# Altium schematic sheet PCB.SchDoc
size A4; PageSetup: Record=PageOptions|CenterHorizontal=True|CenterVertical=True|PrintScale=1.00|XCorrection=1.00|YCorrection=1.00|PrintKind=0|BorderSize=5000000|LeftOffset=0|BottomOffset=0|Orientation=2|PaperLength=1000|PaperWidth=1000|Scale=100|PaperSource=7|PrintQuality=-3|MediaType=1|DitherType=10|PrintScaleMode=1|PaperKind=A4|PaperIndex=9
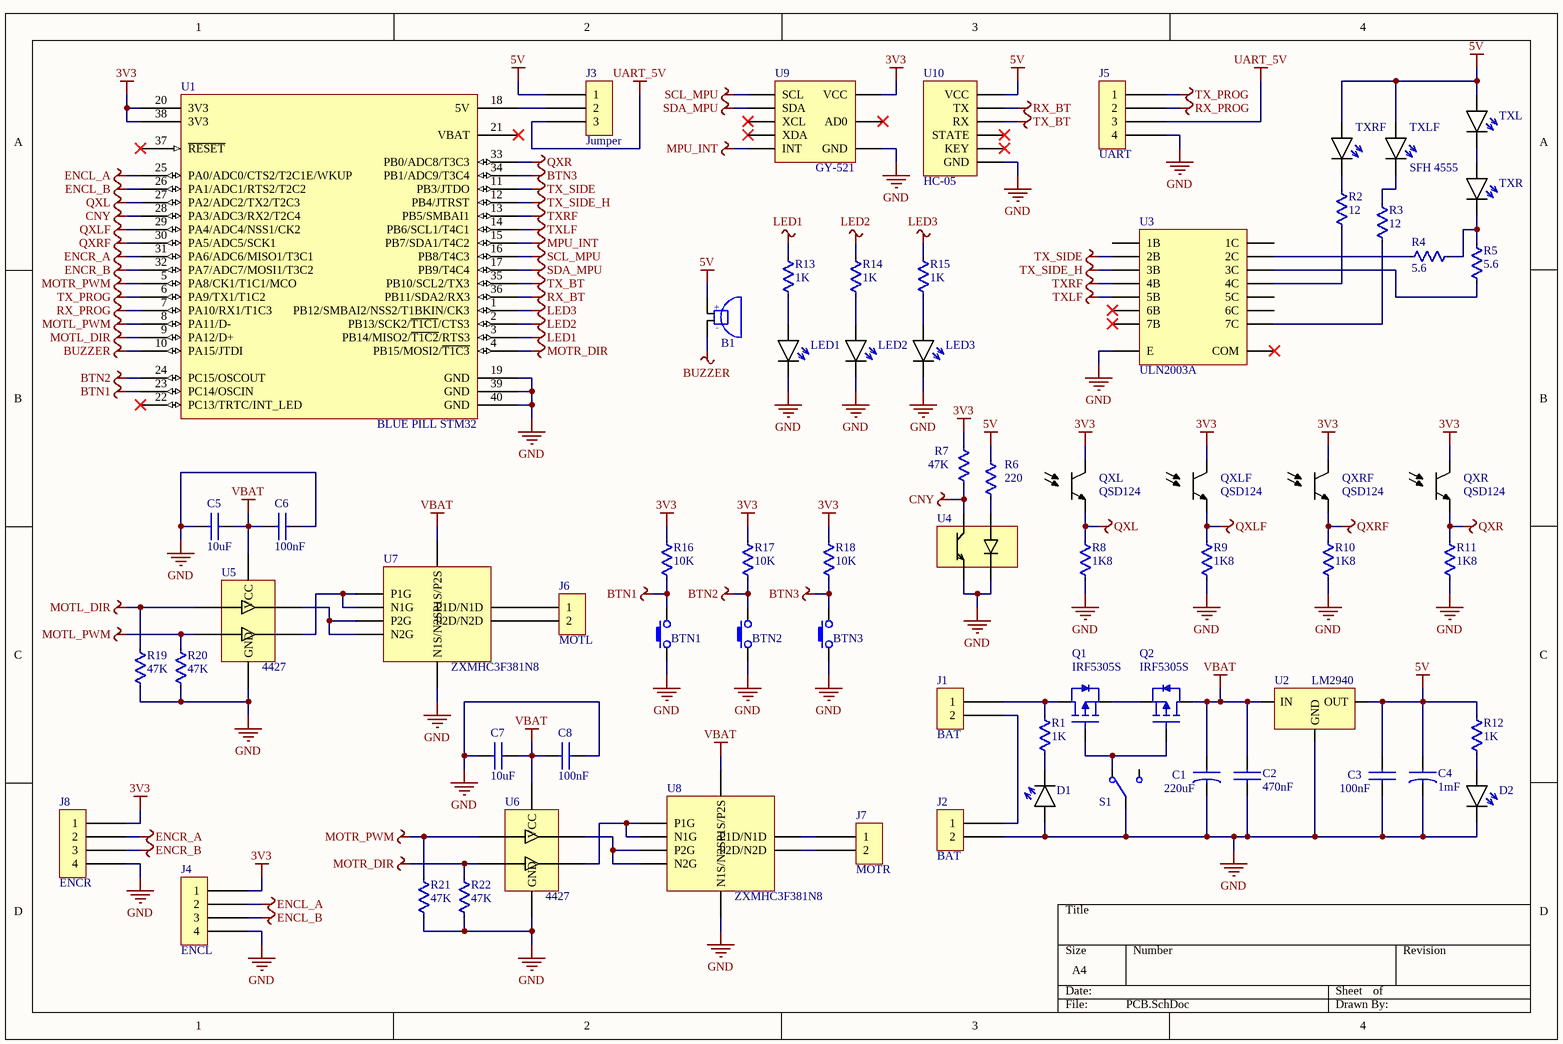
[diagram p0: PCB.SchDoc]

## Parts
B1  BUZZER  [BUZZER-12MM]  (value not drawn)
BTN1  BUTTON  [TACT_SWITCH-SMALL-4PIN]  (value not drawn)
BTN2  BUTTON  [TACT_SWITCH-SMALL-4PIN]  (value not drawn)
BTN3  BUTTON  [TACT_SWITCH-SMALL-4PIN]  (value not drawn)
C1  value 220uF  [CAP-ELEC-5x11x2mm]  (hidden comment: CAP-ELEC)
C2  value 470nF  [C1206]  (hidden comment: CAP-CER)
C3  value 100nF  [C1206]  (hidden comment: CAP-CER)
C4  value 1mF  [CAP-ELEC-5x11x2mm]  (hidden comment: CAP-ELEC)
C5  value 10uF  [C1206]  (hidden comment: CAP-CER)
C6  value 100nF  [C1206]  (hidden comment: CAP-CER)
C7  value 10uF  [C1206]  (hidden comment: CAP-CER)
C8  value 100nF  [C1206]  (hidden comment: CAP-CER)
D1  LED  [LED-3MM-GREEN]  (value not drawn)
D2  LED  [LED-3MM-GREEN]  (value not drawn)
J1  BAT  [HEADER 1x2]
J2  BAT  [HEADER 1x2]
J3  Jumper  [Header 1x3]
J4  ENCL  [Header 1x4]
J5  UART  [Header 1x4]
J6  MOTL  [HEADER 1x2]
J7  MOTR  [HEADER 1x2]
J8  ENCR  [Header 1x4]
LED1  LED  [LED-3MM-GREEN]  (value not drawn)
LED2  LED  [LED-3MM-GREEN]  (value not drawn)
LED3  LED  [LED-3MM-GREEN]  (value not drawn)
Q1  IRF5305S  [TO-263]
Q2  IRF5305S  [TO-263]
QXL  QSD124  [LED-5MM-RED-90-2]
QXLF  QSD124  [LED-5MM-RED-90]
QXR  QSD124  [LED-5MM-RED-90]
QXRF  QSD124  [LED-5MM-RED-90]
R1  value 1K  [R1206]  (hidden comment: RES)
R2  value 12  [R1206]  (hidden comment: RES)
R3  value 12  [R1206]  (hidden comment: RES)
R4  value 5.6  [R1206]  (hidden comment: RES)
R5  value 5.6  [R1206]  (hidden comment: RES)
R6  value 220  [R1206]  (hidden comment: RES)
R7  value 47K  [R1206]  (hidden comment: RES)
R8  value 1K8  [R1206]  (hidden comment: RES)
R9  value 1K8  [R1206]  (hidden comment: RES)
R10  value 1K8  [R1206]  (hidden comment: RES)
R11  value 1K8  [R1206]  (hidden comment: RES)
R12  value 1K  [R1206]  (hidden comment: RES)
R13  value 1K  [R1206]  (hidden comment: RES)
R14  value 1K  [R1206]  (hidden comment: RES)
R15  value 1K  [R1206]  (hidden comment: RES)
R16  value 10K  [R1206]  (hidden comment: RES)
R17  value 10K  [R1206]  (hidden comment: RES)
R18  value 10K  [R1206]  (hidden comment: RES)
R19  value 47K  [R1206]  (hidden comment: RES)
R20  value 47K  [R1206]  (hidden comment: RES)
R21  value 47K  [R1206]  (hidden comment: RES)
R22  value 47K  [R1206]  (hidden comment: RES)
S1  SLIDE-SWITCH  [SWITCH]  (value not drawn)
TXL  LED  [LED-5MM-RED-90-2]  (value not drawn)
TXLF  SFH 4555  [LED-5MM-RED-90]
TXR  LED  [LED-5MM-RED-90]  (value not drawn)
TXRF  LED  [LED-5MM-RED-90]  (value not drawn)
U1  BLUE PILL STM32  [BLUE_PILL]
U2  LM2940  [TO-263]
U3  ULN2003A  [SOIC-16-NARROW]
U4  QRE1113GR  [QRE1113GR]  (value not drawn)
U5  4427  [SOIC-8]
U6  4427  [SOIC-8]
U7  ZXMHC3F381N8  [SOIC-8]
U8  ZXMHC3F381N8  [SOIC-8]
U9  GY-521  [GY-521]
U10  HC-05  [HC-05]

## Nets
3V3: J4.1 J8.1 QXL.C QXLF.C QXR.C QXRF.C R7.2 R16.2 R17.2 R18.2 U1.20(3V3) U1.38(3V3) U9.1(VCC)
5V: B1.1(+) C3.2 C4.1 J3.1 R6.2 R12.2 TXL.A TXLF.A TXRF.A U2.3(OUT) U10.2(VCC)
BTN1: BTN1.2 R16.1 U1.23(PC14/OSCIN)
BTN2: BTN2.2 R17.1 U1.24(PC15/OSCOUT)
BTN3: BTN3.2 R18.1 U1.34(PB1/ADC9/T3C4)
BUZZER: B1.2(-) U1.10(PA15/JTDI)
CNY: R7.1 U1.28(PA3/ADC3/RX2/T2C4) U4.C
ENCL_A: J4.2 U1.25(PA0/ADC0/CTS2/T2C1E/WKUP)
ENCL_B: J4.3 U1.26(PA1/ADC1/RTS2/T2C2)
ENCR_A: J8.2 U1.31(PA6/ADC6/MISO1/T3C1)
ENCR_B: J8.3 U1.32(PA7/ADC7/MOSI1/T3C2)
GND: BTN1.1 BTN2.1 BTN3.1 C1.2 C2.1 C3.1 C4.2 C5.1 C6.1 C7.1 C8.1 D1.A D2.K J2.2 J4.4 J5.4 J8.4 LED1.K LED2.K LED3.K R8.1 R9.1 R10.1 R11.1 R19.1 R20.1 R21.1 R22.1 S1.2 U1.19(GND) U1.39(GND) U1.40(GND) U2.2(GND) U3.8(E) U4.E U4.K U5.3(GND) U6.3(GND) U7.3(N1S/N2S) U8.3(N1S/N2S) U9.2(GND) U10.3(GND)
LED1: R13.2 U1.3(PB14/MISO2/~{T1C2}/RTS3)
LED2: R14.2 U1.2(PB13/SCK2/~{T1C1}/CTS3)
LED3: R15.2 U1.1(PB12/SMBAI2/NSS2/T1BKIN/CK3)
MOTL_DIR: R19.2 U1.9(PA12/D+) U5.2(INA)
MOTL_PWM: R20.2 U1.8(PA11/D-) U5.4(INB)
MOTR_DIR: R22.2 U1.4(PB15/MOSI2/~{T1C3}) U6.4(INB)
MOTR_PWM: R21.2 U1.5(PA8/CK1/T1C1/MCO) U6.2(INA)
MPU_INT: U1.15(PB7/SDA1/T4C2) U9.8(INT)
QXL: QXL.E R8.2 U1.27(PA2/ADC2/TX2/T2C3)
QXLF: QXLF.E R9.2 U1.29(PA4/ADC4/NSS1/CK2)
QXR: QXR.E R11.2 U1.33(PB0/ADC8/T3C3)
QXRF: QXRF.E R10.2 U1.30(PA5/ADC5/SCK1)
RX_BT: U1.36(PB11/SDA2/RX3) U10.4(TX)
RX_PROG: J5.2 U1.7(PA10/RX1/T1C3)
SCL_MPU: U1.16(PB8/T4C3) U9.3(SCL)
SDA_MPU: U1.17(PB9/T4C4) U9.4(SDA)
TX_BT: U1.35(PB10/SCL2/TX3) U10.5(RX)
TX_PROG: J5.1 U1.6(PA9/TX1/T1C2)
TX_SIDE: U1.11(PB3/JTDO) U3.2(2B)
TX_SIDE_H: U1.12(PB4/JTRST) U3.3(3B)
TXLF: U1.14(PB6/SCL1/T4C1) U3.5(5B)
TXRF: U1.13(PB5/SMBAI1) U3.4(4B)
UART_5V: J3.3 J5.3
VBAT: C1.1 C2.2 C5.2 C6.2 C7.2 C8.2 Q2.D U2.1(IN) U5.6(VCC) U6.6(VCC) U7.7(P1S/P2S) U8.7(P1S/P2S)
NetD1_K: D1.K R1.1
NetD2_A: D2.A R12.1
NetJ1_1: J1.1 Q1.D R1.2
NetJ1_2: J1.2 J2.1
NetJ3_2: J3.2 U1.18(5V)
NetJ6_1: J6.1 U7.2(P1D/N1D)
NetJ6_2: J6.2 U7.6(P2D/N2D)
NetJ7_1: J7.1 U8.2(P1D/N1D)
NetJ7_2: J7.2 U8.6(P2D/N2D)
NetLED1_A: LED1.A R13.1
NetLED2_A: LED2.A R14.1
NetLED3_A: LED3.A R15.1
NetQ1_G: Q1.G Q2.G S1.1
NetQ1_S: Q1.S Q2.S
NetR2_1: R2.1 U3.13(4C)
NetR2_2: R2.2 TXRF.K
NetR3_1: R3.1 U3.10(7C)
NetR3_2: R3.2 TXLF.K
NetR4_1: R4.1 R5.2 TXR.K
NetR4_2: R4.2 U3.15(2C)
NetR5_1: R5.1 U3.14(3C)
NetR6_1: R6.1 U4.A
NetTXL_K: TXL.K TXR.A
NetU5_5: U5.5(OUTB) U7.1(N1G) U7.8(P1G)
NetU5_7: U5.7(OUTA) U7.4(N2G) U7.5(P2G)
NetU6_5: U6.5(OUTB) U8.1(N1G) U8.8(P1G)
NetU6_7: U6.7(OUTA) U8.4(N2G) U8.5(P2G)

Not connected (* = marked no-connect by the designer): S1 3; U1 21(VBAT)* 22(PC13/TRTC/INT_LED)* 37(~{RESET})*; U3 1(1B) 6(6B)* 7(7B)* 9(COM)* 11(6C) 12(5C) 16(1C); U9 5(XCL)* 6(XDA)* 7(AD0)*; U10 1(KEY)* 6(STATE)*

## Library data of the parts
B1 = BUZZER-ACTIVE
J1 J2 J6 J7 = Header 1x2
J3 = Header 1x3
J4 J5 J8 = Header 1x4
Q1 Q2 = P-MOSFET: pin to pad: D>2 G>1 S>3
QXL QXLF QXR QXRF = PHOTO NPN: pin to pad: C>A E>K
TXLF = LED
U4 = QRE1113GR: MF: ON Semiconductor; Price: 0.46 USD; MP: QRE1113GR; Package: SMD-4 ON Semiconductor; Availability: Good; Value: *
U9 = GY-521 (MPU6050)